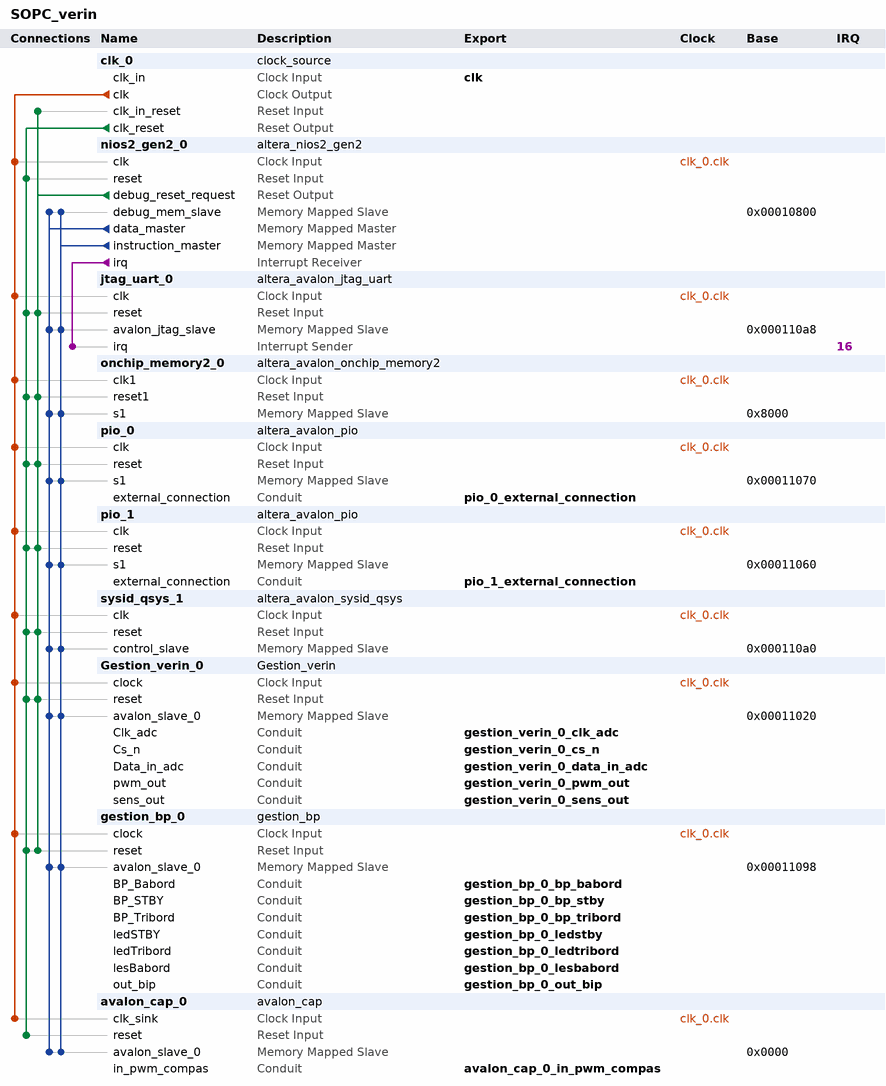
[diagram p0: system contents]
# Platform Designer (Qsys) system SOPC_verin, Cyclone IV E EP4CE22F17C6
# Parameters at their usual value, and those the tool derives, are not listed.
package require -exact qsys 18.0
create_system SOPC_verin
set_project_property DEVICE_FAMILY {Cyclone IV E}
set_project_property DEVICE EP4CE22F17C6

add_instance clk_0 clock_source 18.0
set_instance_parameter_value clk_0 clockFrequency 50000000

add_instance nios2_gen2_0 altera_nios2_gen2 18.0
set_instance_parameter_value nios2_gen2_0 dcache_size 2048
set_instance_parameter_value nios2_gen2_0 exceptionSlave onchip_memory2_0.s1
set_instance_parameter_value nios2_gen2_0 icache_size 4096
set_instance_parameter_value nios2_gen2_0 impl Tiny
set_instance_parameter_value nios2_gen2_0 resetSlave onchip_memory2_0.s1

add_instance jtag_uart_0 altera_avalon_jtag_uart 18.0
set_instance_parameter_value jtag_uart_0 simInteractiveOptions NO_INTERACTIVE_WINDOWS

add_instance onchip_memory2_0 altera_avalon_onchip_memory2 18.0
set_instance_parameter_value onchip_memory2_0 dataWidth 32
set_instance_parameter_value onchip_memory2_0 dualPort false
set_instance_parameter_value onchip_memory2_0 initMemContent true
set_instance_parameter_value onchip_memory2_0 initializationFileName onchip_mem.hex
set_instance_parameter_value onchip_memory2_0 memorySize 20000

add_instance pio_0 altera_avalon_pio 18.0
set_instance_parameter_value pio_0 direction Input
set_instance_parameter_value pio_0 width 8

add_instance pio_1 altera_avalon_pio 18.0
set_instance_parameter_value pio_1 direction Output
set_instance_parameter_value pio_1 width 8

add_instance sysid_qsys_1 altera_avalon_sysid_qsys 18.0
set_instance_parameter_value sysid_qsys_1 id 0

add_instance Gestion_verin_0 Gestion_verin 1.0

add_instance gestion_bp_0 gestion_bp 1.0

add_instance avalon_cap_0 avalon_cap 1.0

# connections
add_connection clk_0.clk avalon_cap_0.clk_sink clock
add_connection clk_0.clk gestion_bp_0.clock clock
add_connection clk_0.clk Gestion_verin_0.clock clock
add_connection clk_0.clk jtag_uart_0.clk clock
add_connection clk_0.clk nios2_gen2_0.clk clock
add_connection clk_0.clk onchip_memory2_0.clk1 clock
add_connection clk_0.clk pio_0.clk clock
add_connection clk_0.clk pio_1.clk clock
add_connection clk_0.clk sysid_qsys_1.clk clock
add_connection clk_0.clk_reset avalon_cap_0.reset reset
add_connection clk_0.clk_reset gestion_bp_0.reset reset
add_connection clk_0.clk_reset Gestion_verin_0.reset reset
add_connection clk_0.clk_reset jtag_uart_0.reset reset
add_connection clk_0.clk_reset nios2_gen2_0.reset reset
add_connection clk_0.clk_reset onchip_memory2_0.reset1 reset
add_connection clk_0.clk_reset pio_0.reset reset
add_connection clk_0.clk_reset pio_1.reset reset
add_connection clk_0.clk_reset sysid_qsys_1.reset reset
add_connection nios2_gen2_0.debug_reset_request clk_0.clk_in_reset reset
add_connection nios2_gen2_0.debug_reset_request gestion_bp_0.reset reset
add_connection nios2_gen2_0.debug_reset_request Gestion_verin_0.reset reset
add_connection nios2_gen2_0.debug_reset_request jtag_uart_0.reset reset
add_connection nios2_gen2_0.debug_reset_request onchip_memory2_0.reset1 reset
add_connection nios2_gen2_0.debug_reset_request pio_0.reset reset
add_connection nios2_gen2_0.debug_reset_request pio_1.reset reset
add_connection nios2_gen2_0.debug_reset_request sysid_qsys_1.reset reset
add_connection nios2_gen2_0.data_master avalon_cap_0.avalon_slave_0 avalon
set_connection_parameter_value nios2_gen2_0.data_master/avalon_cap_0.avalon_slave_0 baseAddress 0x0000
add_connection nios2_gen2_0.data_master gestion_bp_0.avalon_slave_0 avalon
set_connection_parameter_value nios2_gen2_0.data_master/gestion_bp_0.avalon_slave_0 baseAddress 0x00011098
add_connection nios2_gen2_0.data_master Gestion_verin_0.avalon_slave_0 avalon
set_connection_parameter_value nios2_gen2_0.data_master/Gestion_verin_0.avalon_slave_0 baseAddress 0x00011020
add_connection nios2_gen2_0.data_master jtag_uart_0.avalon_jtag_slave avalon
set_connection_parameter_value nios2_gen2_0.data_master/jtag_uart_0.avalon_jtag_slave baseAddress 0x000110a8
add_connection nios2_gen2_0.data_master nios2_gen2_0.debug_mem_slave avalon
set_connection_parameter_value nios2_gen2_0.data_master/nios2_gen2_0.debug_mem_slave baseAddress 0x00010800
add_connection nios2_gen2_0.data_master onchip_memory2_0.s1 avalon
set_connection_parameter_value nios2_gen2_0.data_master/onchip_memory2_0.s1 baseAddress 0x8000
add_connection nios2_gen2_0.data_master pio_0.s1 avalon
set_connection_parameter_value nios2_gen2_0.data_master/pio_0.s1 baseAddress 0x00011070
add_connection nios2_gen2_0.data_master pio_1.s1 avalon
set_connection_parameter_value nios2_gen2_0.data_master/pio_1.s1 baseAddress 0x00011060
add_connection nios2_gen2_0.data_master sysid_qsys_1.control_slave avalon
set_connection_parameter_value nios2_gen2_0.data_master/sysid_qsys_1.control_slave baseAddress 0x000110a0
add_connection nios2_gen2_0.instruction_master avalon_cap_0.avalon_slave_0 avalon
set_connection_parameter_value nios2_gen2_0.instruction_master/avalon_cap_0.avalon_slave_0 baseAddress 0x0000
add_connection nios2_gen2_0.instruction_master gestion_bp_0.avalon_slave_0 avalon
set_connection_parameter_value nios2_gen2_0.instruction_master/gestion_bp_0.avalon_slave_0 baseAddress 0x00011098
add_connection nios2_gen2_0.instruction_master Gestion_verin_0.avalon_slave_0 avalon
set_connection_parameter_value nios2_gen2_0.instruction_master/Gestion_verin_0.avalon_slave_0 baseAddress 0x00011020
add_connection nios2_gen2_0.instruction_master jtag_uart_0.avalon_jtag_slave avalon
set_connection_parameter_value nios2_gen2_0.instruction_master/jtag_uart_0.avalon_jtag_slave baseAddress 0x000110a8
add_connection nios2_gen2_0.instruction_master nios2_gen2_0.debug_mem_slave avalon
set_connection_parameter_value nios2_gen2_0.instruction_master/nios2_gen2_0.debug_mem_slave baseAddress 0x00010800
add_connection nios2_gen2_0.instruction_master onchip_memory2_0.s1 avalon
set_connection_parameter_value nios2_gen2_0.instruction_master/onchip_memory2_0.s1 baseAddress 0x8000
add_connection nios2_gen2_0.instruction_master pio_0.s1 avalon
set_connection_parameter_value nios2_gen2_0.instruction_master/pio_0.s1 baseAddress 0x00011070
add_connection nios2_gen2_0.instruction_master pio_1.s1 avalon
set_connection_parameter_value nios2_gen2_0.instruction_master/pio_1.s1 baseAddress 0x00011060
add_connection nios2_gen2_0.instruction_master sysid_qsys_1.control_slave avalon
set_connection_parameter_value nios2_gen2_0.instruction_master/sysid_qsys_1.control_slave baseAddress 0x000110a0
add_connection nios2_gen2_0.irq jtag_uart_0.irq interrupt
set_connection_parameter_value nios2_gen2_0.irq/jtag_uart_0.irq irqNumber 16

# exported interfaces
add_interface avalon_cap_0_in_pwm_compas conduit end
set_interface_property avalon_cap_0_in_pwm_compas EXPORT_OF avalon_cap_0.in_pwm_compas
add_interface clk clock sink
set_interface_property clk EXPORT_OF clk_0.clk_in
add_interface gestion_bp_0_bp_babord conduit end
set_interface_property gestion_bp_0_bp_babord EXPORT_OF gestion_bp_0.BP_Babord
add_interface gestion_bp_0_bp_stby conduit end
set_interface_property gestion_bp_0_bp_stby EXPORT_OF gestion_bp_0.BP_STBY
add_interface gestion_bp_0_bp_tribord conduit end
set_interface_property gestion_bp_0_bp_tribord EXPORT_OF gestion_bp_0.BP_Tribord
add_interface gestion_bp_0_ledstby conduit end
set_interface_property gestion_bp_0_ledstby EXPORT_OF gestion_bp_0.ledSTBY
add_interface gestion_bp_0_ledtribord conduit end
set_interface_property gestion_bp_0_ledtribord EXPORT_OF gestion_bp_0.ledTribord
add_interface gestion_bp_0_lesbabord conduit end
set_interface_property gestion_bp_0_lesbabord EXPORT_OF gestion_bp_0.lesBabord
add_interface gestion_bp_0_out_bip conduit end
set_interface_property gestion_bp_0_out_bip EXPORT_OF gestion_bp_0.out_bip
add_interface gestion_verin_0_clk_adc conduit end
set_interface_property gestion_verin_0_clk_adc EXPORT_OF Gestion_verin_0.Clk_adc
add_interface gestion_verin_0_cs_n conduit end
set_interface_property gestion_verin_0_cs_n EXPORT_OF Gestion_verin_0.Cs_n
add_interface gestion_verin_0_data_in_adc conduit end
set_interface_property gestion_verin_0_data_in_adc EXPORT_OF Gestion_verin_0.Data_in_adc
add_interface gestion_verin_0_pwm_out conduit end
set_interface_property gestion_verin_0_pwm_out EXPORT_OF Gestion_verin_0.pwm_out
add_interface gestion_verin_0_sens_out conduit end
set_interface_property gestion_verin_0_sens_out EXPORT_OF Gestion_verin_0.sens_out
add_interface pio_0_external_connection conduit end
set_interface_property pio_0_external_connection EXPORT_OF pio_0.external_connection
add_interface pio_1_external_connection conduit end
set_interface_property pio_1_external_connection EXPORT_OF pio_1.external_connection

set_interconnect_requirement {$system} qsys_mm.clockCrossingAdapter HANDSHAKE
set_interconnect_requirement {$system} qsys_mm.enableEccProtection FALSE
set_interconnect_requirement {$system} qsys_mm.insertDefaultSlave FALSE
set_interconnect_requirement {$system} qsys_mm.maxAdditionalLatency 1

save_system SOPC_verin.qsys
